# EAGLE design keg-vol-weight-mon (EAGLE 9.6.2)
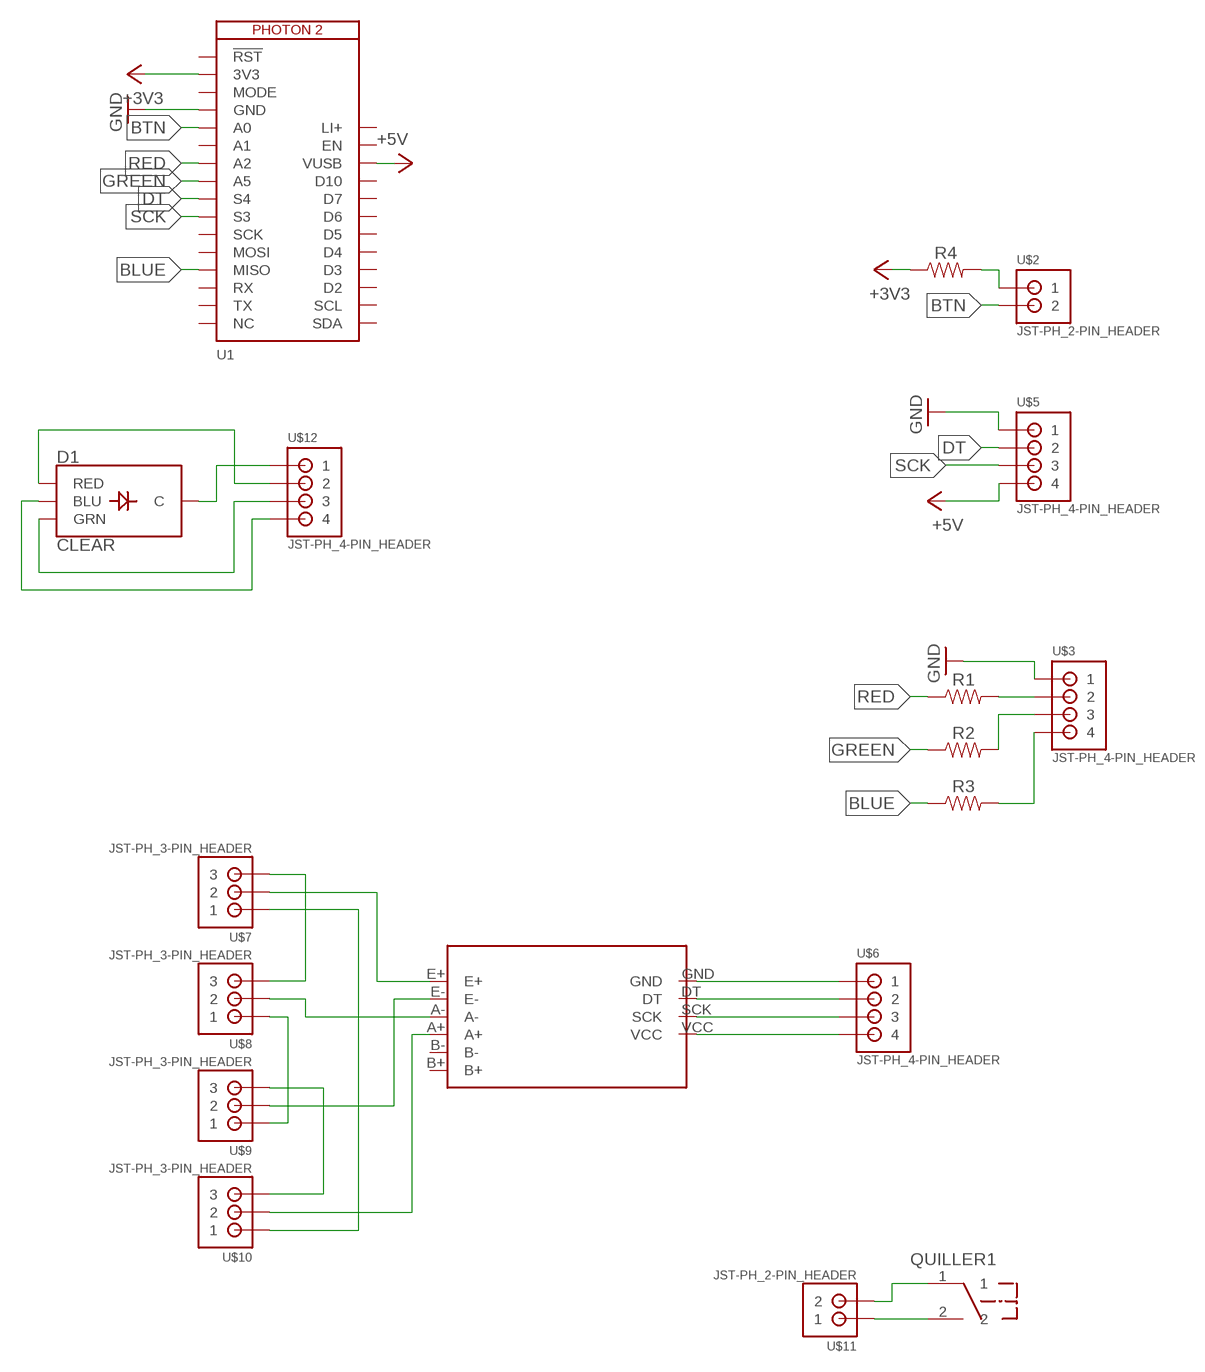
[diagram p0: schematic, sheet 1]

## Parts
D1  CLEAR  LED-RGB-CCCLEAR  [LED-RGB-THRU]
QUILLER1  6MM-2PIN-TAC-MOM-SWITCH  [6MM-2PIN-TAC-MOM-SWITCH]
R1  RESISTORAXIAL-0.3  [AXIAL-0.3]
R2  RESISTORAXIAL-0.3  [AXIAL-0.3]
R3  RESISTORAXIAL-0.3  [AXIAL-0.3]
R4  RESISTORAXIAL-0.3  [AXIAL-0.3]
U1  PHOTON2  [PHOTON2]
U$2  JST-PH_2-PIN_HEADER  [JST_B2B-PH_HEADER]
U$3  JST-PH_4-PIN_HEADER  [JST_B4B-PH_HEADER]
U$4  HX711A  [HX711]
U$5  JST-PH_4-PIN_HEADER  [JST_B4B-PH_HEADER]
U$6  JST-PH_4-PIN_HEADER  [JST_B4B-PH_HEADER]
U$7  JST-PH_3-PIN_HEADER  [JST_B3B-PH_HEADER]
U$8  JST-PH_3-PIN_HEADER  [JST_B3B-PH_HEADER]
U$9  JST-PH_3-PIN_HEADER  [JST_B3B-PH_HEADER]
U$10  JST-PH_3-PIN_HEADER  [JST_B3B-PH_HEADER]
U$11  JST-PH_2-PIN_HEADER  [JST_B2B-PH_HEADER]
U$12  JST-PH_4-PIN_HEADER  [JST_B4B-PH_HEADER]

## Nets
+3V3: R4.P$1 U1.2(3V3)
+5V: U1.26(VUSB) U$5.P4
BLUE: R3.P$1 U1.13(MISO)
BTN: U1.5(A0) U$2.P2
DT: U1.9(S4) U$5.P2
GND: U1.4(GND) U$3.P1 U$5.P1
GREEN: R2.P$1 U1.8(A5)
N$1: R2.P$2 U$3.P3
N$2: R3.P$2 U$3.P4
N$4: R4.P$2 U$2.P1
N$5: U$4.E+ U$7.P2
N$6: R1.P$2 U$3.P2
N$9: U$4.A- U$8.P2
N$10: U$4.E- U$9.P2
N$11: U$4.A+ U$10.P2
N$12: U$7.P3 U$8.P3
N$13: U$8.P1 U$9.P1
N$14: U$9.P3 U$10.P3
N$15: U$7.P1 U$10.P1
N$16: U$4.GND U$6.P1
N$17: U$4.DT U$6.P2
N$18: U$4.SCK U$6.P3
N$19: U$4.VCC U$6.P4
N$20: QUILLER1.1 U$11.P2
N$21: QUILLER1.2 U$11.P1
N$22: D1.2(C) U$12.P1
N$24: D1.4(BLU) U$12.P4
N$25: D1.3(GRN) U$12.P3
N$26: D1.1(RED) U$12.P2
RED: R1.P$1 U1.7(A2)
SCK: U1.10(S3) U$5.P3
Unconnected: U1.1(!RST) U1.3(MODE) U1.6(A1) U1.11(SCK) U1.12(MOSI) U1.14(RX) U1.15(TX) U1.16(NC) U1.17(SDA) U1.18(SCL) U1.19(D2) U1.20(D3) U1.21(D4) U1.22(D5) U1.23(D6) U1.24(D7) U1.25(D10) U1.27(EN) U$4.B+ U$4.B-

## Power pins joined to a net without a drawn wire
LI+: U1.28(LI+)

## Library data of the parts
D1 = SparkFun-LED:LED-RGB-CC: LED-RGB Common Cathode Packages: LED RGB-THRU LED_PIRANHA_5MM SparkFun Products: RGB Diffused Common Cathode- Diffuse <[https://www.sparkfun.com/products/9264]> RGB Diffused Common Cathode - Clear <[https://www.sparkfun.com/products/105]> LED-RGB 5mm Square (Piranha) <[https://www.sparkfun.com/products/11679]>; PROD_ID: DIO-08418
QUILLER1 = QUILLER:6MM-2PIN-TAC-MOM-SWITCH
R1-R4 = SparkFun-Resistors:RESISTOR: Generic Resistor Package
U1 = Particle-Devices:PHOTON2: Particle Photon 2 Wi-Fi enabled development kit Footprint and formfactor based on Adafruit Feather. <https://www.adafruit.com/feather>
U$2 U$11 = SRG:JST-PH_2-PIN_HEADER: 2-pin JST PH Shrouded Header, top entry P/N B2B-PH-K-S Mating connector PHR-2 Mating cable assembly: Sparkfun PRT-09914 <http://www.sparkfun.com/products/9914>
U$3 U$5 U$6 U$12 = SRG:JST-PH_4-PIN_HEADER: 4-pin JST PH Shrouded Header, top entry P/N B4B-PH-K-S Mating connector PHR-4 Mating cable assembly: Sparkfun PRT-09916 <http://www.sparkfun.com/products/9916>
U$4 = HX711:HX711
U$7-U$10 = SRG:JST-PH_3-PIN_HEADER: 3-pin JST PH Shrouded Header, top entry P/N B3B-PH-K-S Mating connector PHR-3

## Board
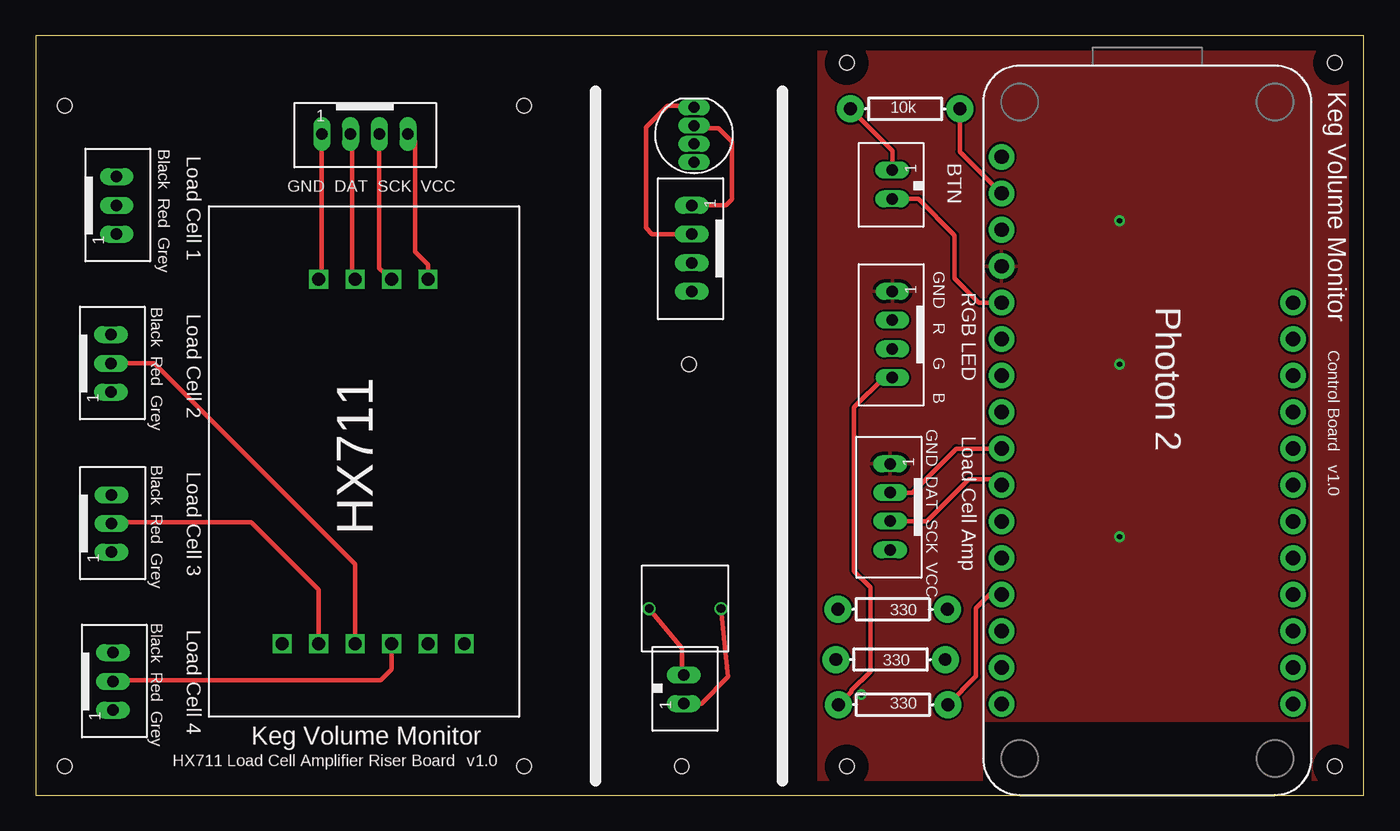
[diagram p1: board, top side]
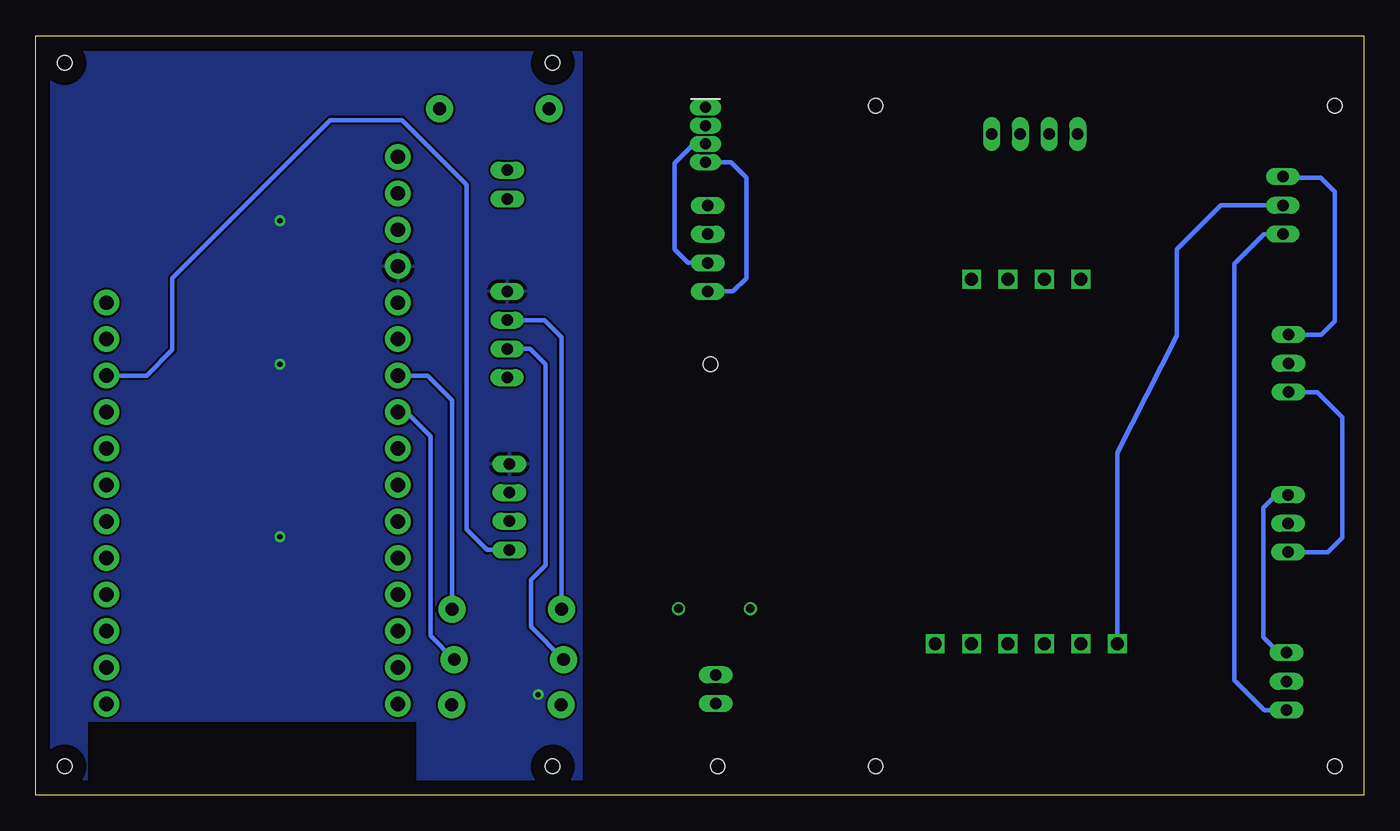
[diagram p2: board, bottom side, seen from below]

Size 92.5 x 52.87 mm. Coordinates in mm from the lower left corner, seen from the top.
Outline: 0,0 92.5,0 92.5,52.87 0,52.87 0,0
Copper layers (1*16): Top 0.035mm / dielectric 1.5mm / Bottom 0.035mm
Design rules "default *": minimum track width 6mil, minimum drill 0.35mm, track to track 6mil, track to pad 6mil, pad to pad 6mil, via to via 6mil, smd to smd 6mil, copper to edge 40mil, drill to drill 6mil, minimum pad ring 6mil, minimum via ring 8mil, stop-mask expansion 4mil, vias tented up to drill 0mil, thermal gap 10mil
Holes 1 mm at 2,48 34,48 34,2 2,2 56.5,51 90.5,51 90.5,2 56.5,2 45,2 45.5,30

### Footprints (pad centres in the part's own frame; a part is rotated, then mirrored left to right if it is on the bottom)
LED-RGB-THRU = drill 0.762 pad 0.889 long: 1 1.905,0; 2 0.635,0; 3 -0.635,0; 4 -1.905,0
6MM-2PIN-TAC-MOM-SWITCH = drill 0.6: 1 -2.5,0; 2 2.5,0
AXIAL-0.3 = drill 0.9 pad 1.88: P$1 -3.81,0; P$2 3.81,0
PHOTON2 = drill 1 pad 1.778: 1 1.27,44.45; 2 1.27,41.91; 3 1.27,39.37; 4 1.27,36.83; 5 1.27,34.29; 6 1.27,31.75; 7 1.27,29.21; 8 1.27,26.67; 9 1.27,24.13; 10 1.27,21.59; 11 1.27,19.05; 12 1.27,16.51; 13 1.27,13.97; 14 1.27,11.43; 15 1.27,8.89; 16 1.27,6.35; 17 21.59,6.35; 18 21.59,8.89; 19 21.59,11.43; 20 21.59,13.97; 21 21.59,16.51; 22 21.59,19.05; 23 21.59,21.59; 24 21.59,24.13; 25 21.59,26.67; 26 21.59,29.21; 27 21.59,31.75; 28 21.59,34.29
JST_B2B-PH_HEADER = drill 0.8 long: P1 1.075,0.048; P2 -0.925,0.048
JST_B4B-PH_HEADER = drill 0.8 long: P1 2.98,0.048; P2 0.98,0.048; P3 -1.02,0.048; P4 -3.02,0.048
HX711 = drill 0.9 square: A+ 5.08,8.89; A- 5.08,11.43; B+ 5.08,3.81; B- 5.08,6.35; DT 30.48,11.43; E+ 5.08,16.51; E- 5.08,13.97; GND 30.48,13.97; SCK 30.48,8.89; VCC 30.48,6.35
JST_B3B-PH_HEADER = drill 0.8 long: P1 2.027,0.048; P2 0.028,0.048; P3 -1.972,0.048

### Placement (x,y rotation side)
D1  45.85,45.99 90 top
QUILLER1  45.23,12.99 0 top
R1  59.7,12.94 180 top
R2  59.54,9.44 180 top
R3  59.72,6.29 180 top
R4  60.56,47.79 180 top
U1  66,0 0 top
U$2  59.71,42.44 90 top
U$3  59.72,32.09 90 top
U$4  33.66,5.45 90 top
U$5  59.56,20.09 90 top
U$6  22.9,46.09 180 top
U$7  5.58,41.09 270 top
U$8  5.19,30.09 270 top
U$9  5.22,18.94 270 top
U$10  5.33,7.94 270 top
U$11  45.09,7.44 270 top
U$12  45.74,38.09 90 top

### Tracks (layer width: path | path; a pad name or v marks a point on that pad's centre or on a via)
+3V3
  Top 0.305: R4.P$1 64.37,44.81 U1.2
+5V
  Bottom 0.305: U$5.P4 61.07,17.07 62.5,18.5 62.5,42.5 67,47 72,47 83,36 83,31 84.79,29.21 U1.26
BLUE
  Top 0.305: R3.P$1 65.5,8.26 65.5,13 66.47,13.97 U1.13
BTN
  Top 0.305: U$2.P2 61.48,41.52 64,39 64,36 65.71,34.29 U1.5
DT
  Top 0.305: U$5.P2 61.07,21.07 64.13,24.13 U1.9
GND  (via drill 0.35)
  other vias: 75.5,40 75.5,30 75.5,18 57.5,7
  pour Top: 54.5,52 54.5,-1 96,-1 96,52
  pour Bottom: 54.5,52 54.5,-1 95.5,-1 95.5,52
GREEN
  Bottom 0.305: R2.P$1 65,11.09 65,25 66.67,26.67 U1.8
N$1
  Bottom 0.305: R2.P$2 58,11.71 58,15 57,16 57,30 58.07,31.07 U$3.P3
N$2
  Top 0.305: R3.P$2 56.82,7.2 56.82,7.28 58.13,8.6 58.13,14.46 57,15.59 57,27 59.07,29.07 U$3.P4
N$4
  Top 0.305: R4.P$2 59.66,44.88 U$2.P1
N$5
  Bottom 0.305: U$4.E+ 17.15,23.82 13,32 13,38 9.94,41.06 U$7.P2
N$6
  Bottom 0.305: R1.P$2 55.89,31.89 57.07,33.07 U$3.P2
N$9
  Top 0.305: U$4.A- 22.23,16.07 8.24,30.06 U$8.P2
N$10
  Top 0.305: U$4.E- 19.69,14.31 15,19 5.36,19 U$9.P2
N$11
  Top 0.305: U$4.A+ 24.77,8.77 24,8 5.46,8 U$10.P2
N$12
  Bottom 0.305: U$7.P3 5.57,43 3,43 2,42 2,33 2.94,32.06 U$8.P3
N$13
  Bottom 0.305: U$8.P1 3.24,28.06 1.5,26.32 1.5,17.91 2.5,16.91 U$9.P1
N$14
  Bottom 0.305: U$9.P3 6.09,20.91 7,20 7,11 5.91,9.91 U$10.P3
N$15
  Bottom 0.305: U$7.P1 6.94,39.06 9,37 9,8 6.91,5.91 U$10.P1
N$16
  Top 0.305: U$6.P1 19.92,36.16 U$4.GND
N$17
  Top 0.305: U$4.DT 22.02,36.14 22.02,45.94 U$6.P2
N$18
  Top 0.305: U$6.P3 23.92,36.7 U$4.SCK
N$19
  Top 0.305: U$4.VCC 27.31,36.93 26.42,37.82 26.42,45.54 U$6.P4
N$20
  Top 0.305: U$11.P2 45,8.5 45,10.22 QUILLER1.1
N$21
  Top 0.305: U$11.P1 46.37,6.37 48.23,8.23 QUILLER1.2
N$22
  Top 0.305: U$12.P1 48.07,41.07 48.5,41.5 48.5,45.5 47.55,46.45 46.02,46.45 D1.2
N$24
  Bottom 0.305: U$12.P4 43.93,35.07 43,36 43,43 44.09,44.09 D1.4
N$25
  Bottom 0.305: U$12.P3 47.07,37.07 48,38 48,44 46.65,45.35 D1.3
N$26
  Top 0.305: U$12.P2 42.93,39.07 42.5,39.5 42.5,46.5 44,48 45.74,48 D1.1
RED
  Bottom 0.305: R1.P$1 63.51,27.51 65.21,29.21 U1.7
SCK
  Top 0.305: U$5.P3 62.07,19.07 65,22 66.86,22 U1.10

### Text on the board
tNames: Keg Volume Monitor | 10k | Black Red Grey | Load Cell 1 | BTN | GND DAT SCK VCC | GND R G B | RGB LED | Black Red Grey | Load Cell 2 | Photon 2 | Control Board | GND DAT SCK VCC | Load Cell Amp | Black Red Grey | v1.0 | Load Cell 3 | Black Red Grey | Load Cell 4 | 330 | 330 | 330 | Keg Volume Monitor | HX711 Load Cell Amplifier Riser Board | v1.0
tValues: B G R GND